# EAGLE design OOBDROID_V1 (EAGLE 7.2.0)
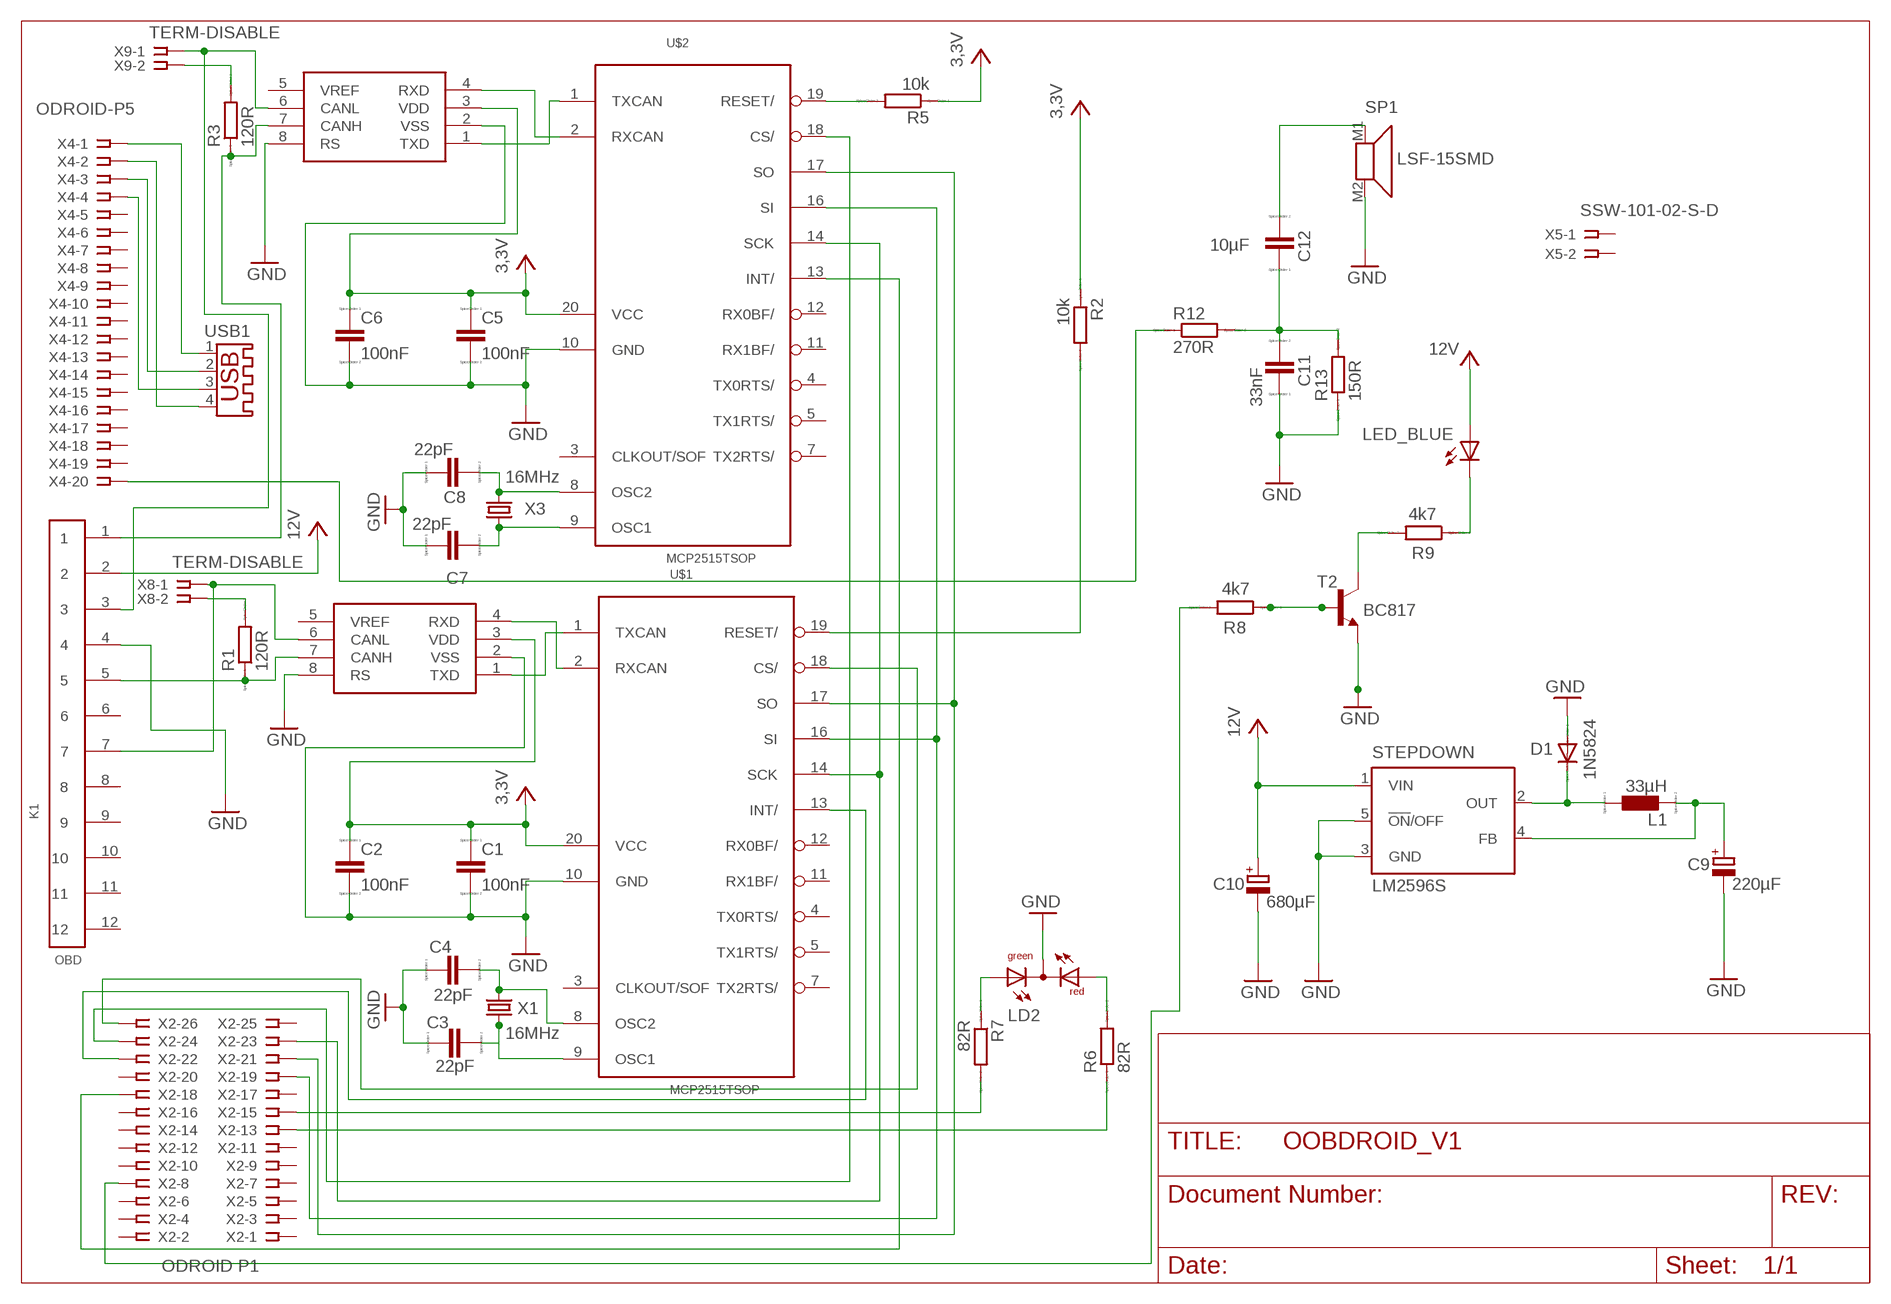
[diagram p0: schematic, sheet 1]

## Parts
C1  100nF  C  [C0805]
C2  100nF  C  [C0805]
C3  22pF  C  [C0805]
C4  22pF  C  [C0805]
C5  100nF  C  [C0805]
C6  100nF  C  [C0805]
C7  22pF  C  [C0805]
C8  22pF  C  [C0805]
C9  220µF  CPOL-EUE1.8-4  [E1,8-4]
C10  680µF  CPOL-EUE1.8-4  [E1,8-4]
C11  33nF  C  [C0805]
C12  10µF  C  [C0805]
D1  1N5824  DIODE-DO214AA  [DO214AA]
K1  OBD  653112124022  [653112124022]
L1  33µH  LL4532P  [L4532P]
LD2  DUOLED-RG-C  [DUOLED-C-5MM]
LED_BLUE  LED5MM  [LED5MM]
R1  120R  RR0603  [R0603]
R2  10k  RR0603  [R0603]
R3  120R  RR0603  [R0603]
R5  10k  RR0603  [R0603]
R6  82R  RR0603  [R0603]
R7  82R  RR0603  [R0603]
R8  4k7  RR0603  [R0603]
R9  4k7  RR0603  [R0603]
R12  270R  RR0603  [R0603]
R13  150R  RR0603  [R0603]
SP1  LSF-15SMD  SMS-1308MS-2-RLSF-15SMD  [SMS-1308MS-2-R]
STEPDOWN  LM2596S  [TO263-5]
T2  BC817  BC847  [SOT23]
U1  MCP2551  [SO08]
U2  MCP2551  [SO08]
U$1  MCP2515TSOP  [TSSOP20]
U$2  MCP2515TSOP  [TSSOP20]
USB1  USB-A003  [USB-A003]
X1  16MHz  CRYSTALS-NOGND-HC49  [HC49]
X2  ODROID P1  SSW-113-02-S-D  [SSW-113-02-S-D]
X3  16MHz  CRYSTALS-NOGND-HC49  [HC49]
X4  ODROID-P5  SSW-120-02-S-S  [SSW-120-02-S-S]
X5  SSW-101-02-S-D  [SSW-101-02-S-D]
X8  TERM-DISABLE  SSW-101-02-S-D  [SSW-101-02-S-D]
X9  TERM-DISABLE  SSW-101-02-S-D  [SSW-101-02-S-D]

## Nets
GND: C1.2 C2.2 C3.1 C4.1 C5.2 C6.2 C7.1 C8.1 C9.- C10.- C11.1 D1.A K1.4 LD2.C R13.1 SP1.M2 STEPDOWN.3(GND) STEPDOWN.5(!ON!/OFF) T2.2(E) U1.2(VSS) U1.8(RS) U2.2(VSS) U2.8(RS) U$1.10(GND) U$2.10(GND)
N$1: K1.5 R1.1 U1.7(CANH)
N$2: D1.C L1.1 STEPDOWN.2(OUT)
N$3: C8.2 U$2.8(OSC2) X3.2
N$4: C9.+ L1.2 STEPDOWN.4(FB)
N$5: C7.2 U$2.9(OSC1) X3.1
N$6: R5.2 U$2.19(RESET/)
N$7: U2.4(RXD) U$2.2(RXCAN)
N$8: U2.1(TXD) U$2.1(TXCAN)
N$9: K1.3 U2.6(CANL) X9.1
N$10: K1.1 R3.1 U2.7(CANH)
N$11: C4.2 U$1.8(OSC2) X1.2
N$12: C3.2 U$1.9(OSC1) X1.1
N$13: R2.2 U$1.19(RESET/)
N$14: U1.4(RXD) U$1.2(RXCAN)
N$15: U1.1(TXD) U$1.1(TXCAN)
N$16: K1.7 U1.6(CANL) X8.1
N$17: C12.2 SP1.M1
N$18: LED_BLUE.K(C) R9.1
N$19: U$1.18(CS/) X2.26
N$21: R3.2 X9.2
N$22: LD2.AR R6.2
N$23: LD2.AX(AG) R7.1
N$24: R7.2 X2.15
N$25: R6.1 X2.13
N$26: USB1.1 X4.1
N$27: USB1.4 X4.2
N$28: USB1.2 X4.3
N$29: USB1.3 X4.4
N$30: R12.1 X4.20
N$31: U$1.13(INT/) X2.22
N$32: U$2.13(INT/) X2.18
N$33: U$2.18(CS/) X2.24
N$34: R9.2 T2.3(C)
N$35: R8.1 T2.1(B)
N$36: R8.2 X2.8
N$37: C11.2 C12.1 R12.2 R13.2
N$38: U$1.16(SI) U$2.16(SI) X2.19
N$39: R1.2 X8.2
N$43: U$1.17(SO) U$2.17(SO) X2.21
N$44: U$1.14(SCK) U$2.14(SCK) X2.23
VCC: C1.1 C2.1 C5.1 C6.1 C10.+ K1.2 LED_BLUE.A R2.1 R5.1 STEPDOWN.1(VIN) U1.3(VDD) U2.3(VDD) U$1.20(VCC) U$2.20(VCC) ; supply symbol labelled 3,3V, 12V
Unconnected: K1.6 K1.8 K1.9 K1.10 K1.11 K1.12 U1.5(VREF) U2.5(VREF) U$1.3(CLKOUT/SOF) U$1.4(TX0RTS/) U$1.5(TX1RTS/) U$1.7(TX2RTS/) U$1.11(RX1BF/) U$1.12(RX0BF/) U$2.3(CLKOUT/SOF) U$2.4(TX0RTS/) U$2.5(TX1RTS/) U$2.7(TX2RTS/) U$2.11(RX1BF/) U$2.12(RX0BF/) X2.1 X2.2 X2.3 X2.4 X2.5 X2.6 X2.7 X2.9 X2.10 X2.11 X2.12 X2.14 X2.16 X2.17 X2.20 X2.25 X4.5 X4.6 X4.7 X4.8 X4.9 X4.10 X4.11 X4.12 X4.13 X4.14 X4.15 X4.16 X4.17 X4.18 X4.19 X5.1 X5.2

## Library data of the parts
C1-C8 C11 C12 = eagle-ltspice:C: CAPACITOR, European symbol; SPICEMODEL: NONE; SPICEPREFIX: C
C9 C10 = resistor:CPOL-EU: POLARIZED CAPACITOR, European symbol
D1 = diode:DIODE-: DIODE
K1 = EagleLibrary_Wuerth_Elektronik _eiCan_Wire_to_Board_Connectors_v6_20150113:653112124022: WR-WTB 1.25mm SMT Male Vertical Shrouded Header, 12 Pins=>Code : Con_WTB_1.25_PCB_SMT_653112124022 <http://katalog.we-online.de/media/thumbs2/eican/thb_Con_WTB_1.25_PCB_SMT_6530xx124022_pf2.psd.jpg> Details see: http://katalog.we-online.de/en/em/653_1xx_124_022 Created 2014-06-06, Karrer Zheng 2014 (C) Würth Elektronik
L1 = eagle-ltspice:L: INDUCTOR, European symbol; SPICEMODEL: NONE; SPICEPREFIX: L
LD2 = led:DUOLED-RG-C: DUO LED 2 colors (red/green), 5 mm, round, common Cathode www.ligitek.com or other producers.
LED_BLUE = adafruit:LED: LED OSRAM: - CHIPLED LG R971, LG N971, LY N971, LG Q971, LY Q971, LO R971, LY R971 LH N974, LH R974 LS Q976, LO Q976, LY Q976 LO Q996 - Hyper CHIPLED LW Q18S LB Q993, LB Q99A, LB R99A - SideLED LS A670, LO A670, LY A670, LG A670, LP A670 LB A673, LV A673, LT A673, LW A673 LH A674 LY A675 LS A676, LA A676, LO A676, LY A676, LW A676 LS A679, LY A679, LG A679 - Hyper Micro SIDELED® LS Y876, LA Y876, LO Y876, LY Y876 LT Y87S - SmartLED LW L88C, LW L88S LB L89C, LB L89S, LG L890 LS L89K, LO L89K, LY L89K LS L896, LA L896, LO L896, LY L896 - TOPLED LS T670, LO T670, LY T670, LG T670, LP T670 LSG T670, LSP T670, LSY T670, LOP T670, LYG T670 LG T671, LOG T671, LSG T671 LB T673, LV T673, LT T673, LW T673 LH T674 LS T676, LA T676, LO T676, LY T676, LB T676, LH T676, LSB T676, LW T676 LB T67C, LV T67C, LT T67C, LS T67K, LO T67K, LY T67K, LW E67C LS E67B, LA E67B, LO E67B, LY E67B, LB E67C, LV E67C, LT E67C LW T67C LS T679, LY T679, LG T679 LS T770, LO T770, LY T770, LG T770, LP T770 LB T773, LV T773, LT T773, LW T773 LH T774 LS E675, LA E675, LY E675, LS T675 LS T776, LA T776, LO T776, LY T776, LB T776 LHGB T686 LT T68C, LB T68C - Hyper Mini TOPLED® LB M676 - Mini TOPLED Santana® LG M470 LS M47K, LO M47K, LY M47K Source: http://www.osram.convergy.de/
R1-R3 R5-R9 R12 R13 = eagle-ltspice:R: RESISTOR, European symbol; SPICEMODEL: NONE; SPICEPREFIX: R
SP1 = speaker:SMS-1308MS-2-R: Speaker 13 x 13mm, 8 Ohm, 0.7W Source: pui audio inc. SMS-1308MS-2-R.pdf
STEPDOWN = national-semiconductor:LM2596: SIMPLE SWITCHER® Power Converter 150 kHz 3A Step-Down Voltage Regulator Source: http://www.national.com/ds/LM/LM2596.pdf; MF: NATIONAL SEMICONDUCTOR; MPN: LM2596S-ADJ/NOPB; OC_FARNELL: 9494367; OC_NEWARK: 41K3842
T2 = transistor:BC847: NPN TRANSISTOR
U1 U2 = SparkFun:MCP2551
U$1 U$2 = MCP2515_MT:MCP2515*: MCP2515 Standalone CAN-Controller by Microchip Eagle-Lib. by MartinThomas
USB1 = con-yamaichi:USB-A003: USB connector; OC_FARNELL: unknown; OC_NEWARK: unknown
X1 X3 = IQD-Frequency-Products:CRYSTALS-NOGND: CRYSTALS CAN NOT GROUNDED
X2 = con-samtec:SSW-113-02-S-D: THROUGH-HOLE .025" SQ POST SOCKET Source: Samtec SSW.pdf; MPN: SSW-113-02-S-D; OC_FARNELL: unknown; OC_NEWARK: 11P9530
X4 = con-samtec:SSW-120-02-S-S: THROUGH-HOLE .025" SQ POST SOCKET Source: Samtec SSW.pdf; MPN: SSW-120-02-S-S; OC_FARNELL: unknown; OC_NEWARK: 11P9641
X5 X9 = con-samtec:SSW-101-02-S-D: THROUGH-HOLE .025" SQ POST SOCKET Source: Samtec SSW.pdf; MPN: SSW-101-02-S-D; OC_FARNELL: unknown; OC_NEWARK: 82P1456
X8 = con-samtec:SSW-101-02-S-D: THROUGH-HOLE .025" SQ POST SOCKET Source: Samtec SSW.pdf; MPN: CAN-DISABLE; OC_FARNELL: unknown; OC_NEWARK: 82P1456

## Net classes
0 default: clearance 0.205 mm

## Board
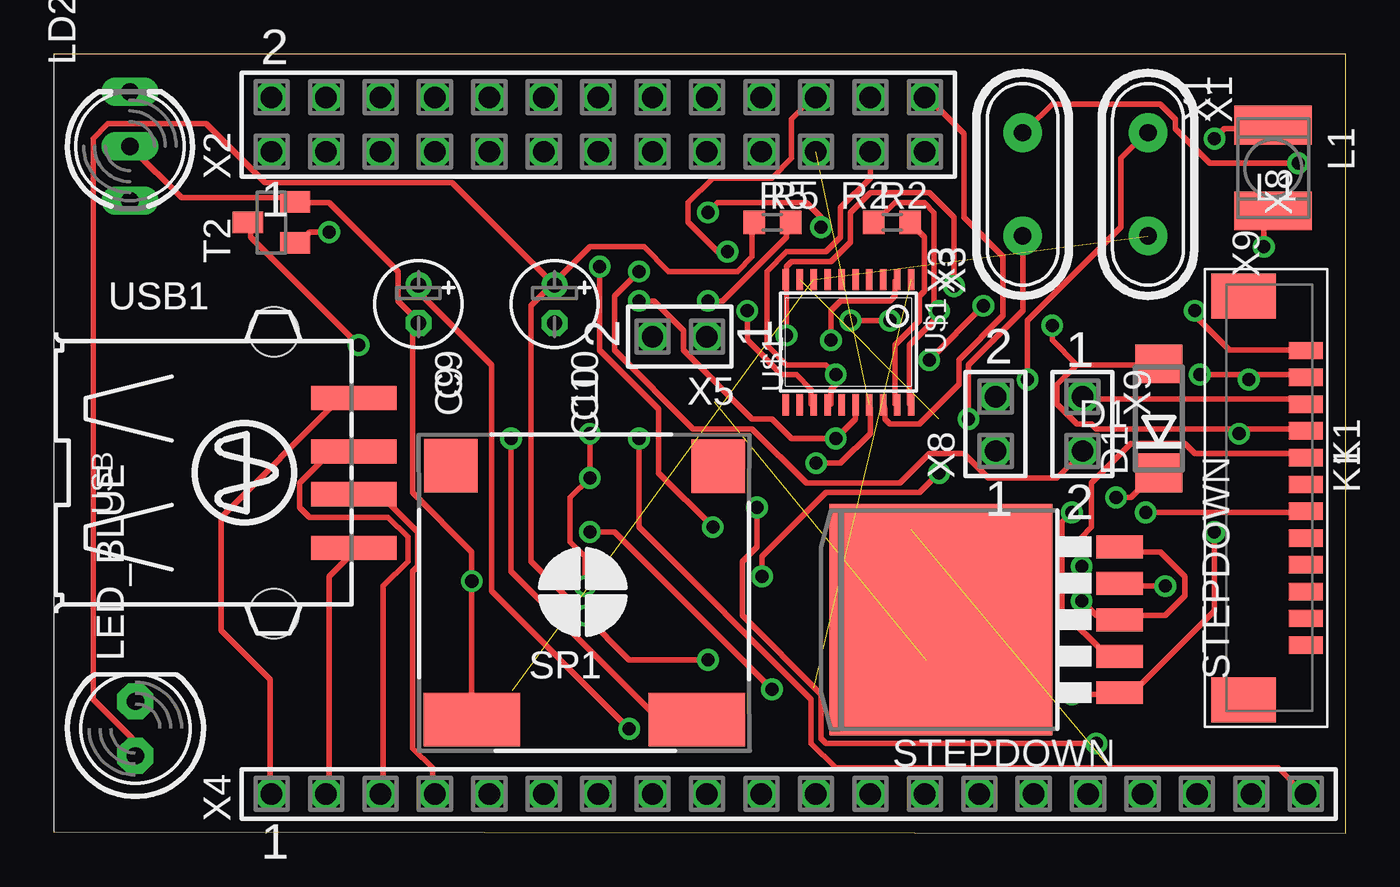
[diagram p1: board, top side]
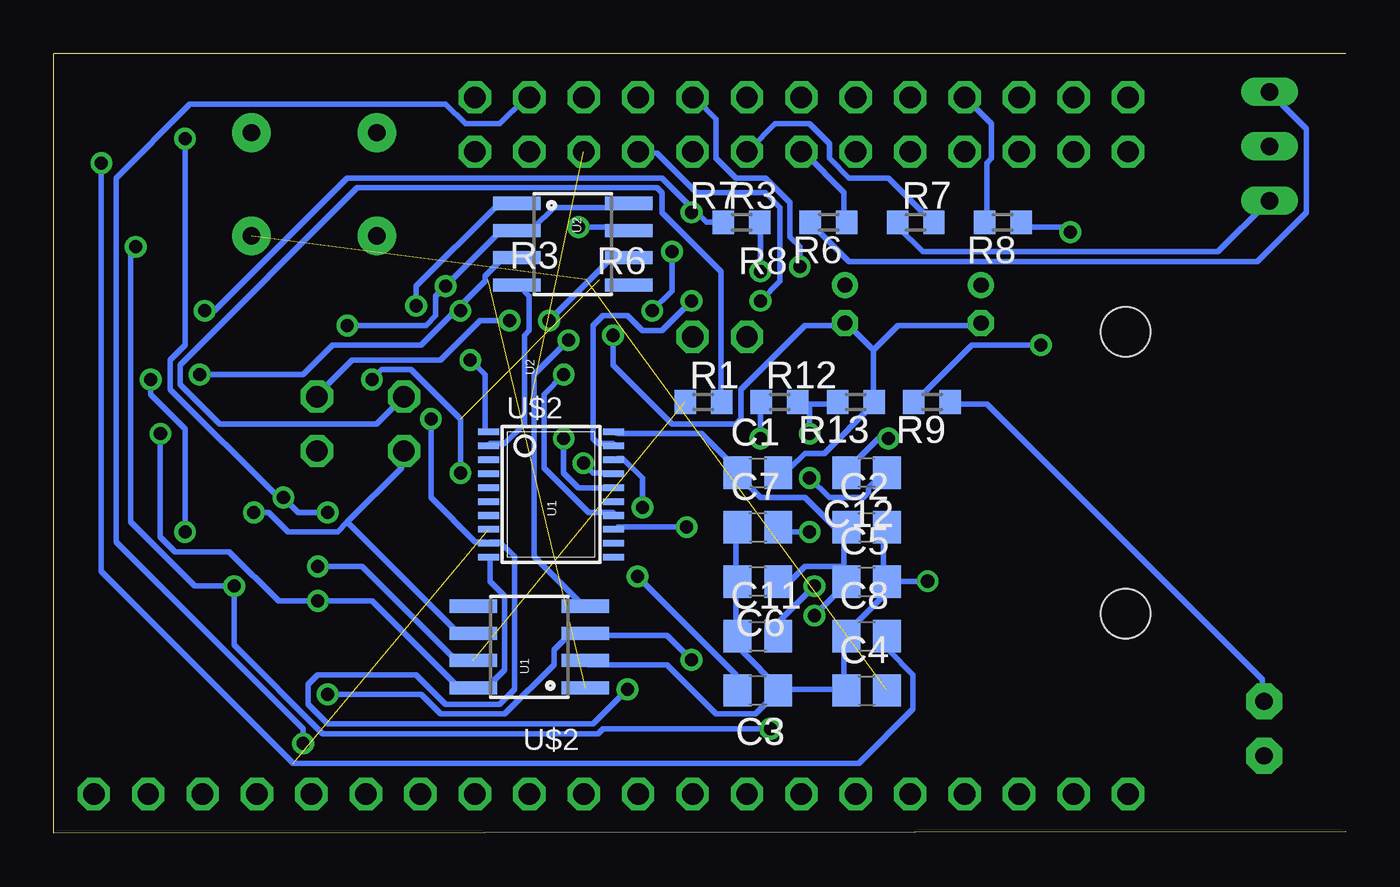
[diagram p2: board, bottom side, seen from below]

Size 60.3 x 36.38 mm. Coordinates in mm from the lower left corner, seen from the top.
Outline: 0.01,0.05 60.3,0 60.3,36.38 0,36.38
Copper layers (1*16): Top 0.035mm / dielectric 1.5mm / Bottom 0.035mm
Design rules "default": minimum track width 10mil, minimum drill 24mil, track to track 8mil, track to pad 8mil, pad to pad 8mil, via to via 8mil, smd to smd 8mil, copper to edge 40mil, drill to drill 8mil, minimum pad ring 10mil, minimum via ring 8mil, stop-mask expansion 4mil, vias tented up to drill 0mil, thermal gap 10mil

### Footprints (pad centres in the part's own frame; a part is rotated, then mirrored left to right if it is on the bottom)
C0805 = smd 1.3 x 1.5: 1 -0.95,0; 2 0.95,0
E1,8-4 = drill 0.711 pad 1.168: + -0.889,0 | drill 0.711 pad 1.168 octagon: - 0.889,0
DO214AA = smd 1.8 x 2.2: A 2.55,0; C -2.55,0
653112124022 = smd 0.81 x 1.6: 1 -0.625,0; 2 0.625,0; 3 1.875,0; 4 3.125,0; 5 4.375,0; 6 5.625,0; 7 6.875,0; 8 8.125,0; 9 9.375,0; 10 10.625,0; 11 11.875,0; 12 13.125,0 | smd 2.1 x 3: Z1 -3.175,-2.9; Z2 15.675,-2.9
L4532P = smd 1.8 x 3.6: 1 -2,0; 2 2,0
DUOLED-C-5MM = drill 0.813 long: AR 2.54,0; AX -2.54,0; C 0,0
LED5MM = drill 0.813 pad 1.676 octagon: A -1.27,0; K 1.27,0
R0603 = smd 1 x 1.1: 1 -0.85,0; 2 0.85,0
SMS-1308MS-2-R = smd 2.5 x 2.5: + 7.636,6.915; - -4.842,6.941 | smd 4.5 x 2.5: M1 6.636,-4.912; M2 -3.851,-4.909
TO263-5 = smd 1.067 x 2.159: 1 -3.404,-5.791; 2 -1.702,-5.791; 3 0,-5.791; 4 1.702,-5.791; 5 3.404,-5.791 | smd 10.8 x 10.41: 6 0,2.54
SOT23 = smd 1 x 1.4: 1 -0.95,-1.1; 2 0.95,-1.1; 3 0,1.1
SO08 = smd 0.61 x 2.21: 1 -1.905,-2.616; 2 -0.635,-2.616; 3 0.635,-2.616; 4 1.905,-2.616; 5 1.905,2.616; 6 0.635,2.616; 7 -0.635,2.616; 8 -1.905,2.616
TSSOP20 = smd 0.305 x 0.991: 1 -2.925,-2.918; 2 -2.275,-2.918; 3 -1.625,-2.918; 4 -0.975,-2.918; 5 -0.325,-2.918; 6 0.325,-2.918; 7 0.975,-2.918; 8 1.625,-2.918; 9 2.275,-2.918; 10 2.925,-2.918; 11 2.925,2.918; 12 2.275,2.918; 13 1.625,2.918; 14 0.975,2.918; 15 0.325,2.918; 16 -0.325,2.918; 17 -0.975,2.918; 18 -1.625,2.918; 19 -2.275,2.918; 20 -2.925,2.918
USB-A003 = smd 1.12 x 4: 1 -3.5,14; 2 -1,14; 3 1,14; 4 3.5,14 | hole 2.3: -6.57,10.28; 6.57,10.28
HC49 = drill 0.813 pad 1.8: 1 -2.413,0; 2 2.413,0
SSW-113-02-S-D = drill 1 pad 1.5 octagon: 1 -15.24,-1.27; 2 -15.24,1.27; 3 -12.7,-1.27; 4 -12.7,1.27; 5 -10.16,-1.27; 6 -10.16,1.27; 7 -7.62,-1.27; 8 -7.62,1.27; 9 -5.08,-1.27; 10 -5.08,1.27; 11 -2.54,-1.27; 12 -2.54,1.27; 13 0,-1.27; 14 0,1.27; 15 2.54,-1.27; 16 2.54,1.27; 17 5.08,-1.27; 18 5.08,1.27; 19 7.62,-1.27; 20 7.62,1.27; 21 10.16,-1.27; 22 10.16,1.27; 23 12.7,-1.27; 24 12.7,1.27; 25 15.24,-1.27; 26 15.24,1.27
SSW-120-02-S-S = drill 1 pad 1.5 octagon: 1 -24.13,0; 2 -21.59,0; 3 -19.05,0; 4 -16.51,0; 5 -13.97,0; 6 -11.43,0; 7 -8.89,0; 8 -6.35,0; 9 -3.81,0; 10 -1.27,0; 11 1.27,0; 12 3.81,0; 13 6.35,0; 14 8.89,0; 15 11.43,0; 16 13.97,0; 17 16.51,0; 18 19.05,0; 19 21.59,0; 20 24.13,0
SSW-101-02-S-D = drill 1 pad 1.5 octagon: 1 0,-1.27; 2 0,1.27

### Placement (x,y rotation side)
C1  27.44,16.82 0 bottom
C2  22.36,14.28 0 bottom
C3  27.44,6.66 180 bottom
C4  22.36,6.66 0 bottom
C5  22.36,11.74 0 bottom
C6  27.44,11.74 180 bottom
C7  27.44,14.28 0 bottom
C8  22.36,9.2 0 bottom
C9  17.03,24.69 270 top
C10  23.38,24.69 270 top
C11  27.44,9.2 0 bottom
C12  22.36,16.82 180 bottom
D1  51.57,19.36 90 top
K1  58.43,21.9 270 top
L1  56.9,31.04 270 top
LD2  3.56,32.06 90 top
LED_BLUE  3.82,4.88 90 top
R1  29.98,20.12 0 bottom
R2  39.12,28.5 0 top
R3  28.2,28.5 0 bottom
R5  33.54,28.5 0 top
R6  24.14,28.5 180 bottom
R7  20.07,28.5 0 bottom
R8  16.01,28.5 180 bottom
R9  19.31,20.12 180 bottom
R12  26.42,20.12 0 bottom
R13  22.87,20.12 180 bottom
SP1  23.38,10.21 0 top
STEPDOWN  43.95,9.96 90 top
T2  10.17,28.5 90 top
U1  38.11,8.69 90 bottom
U2  36.08,27.49 270 bottom
U$1  37.09,22.91 180 top
U$2  37.09,15.8 270 bottom
USB1  0.01,16.82 270 top
X1  51.06,30.28 270 top
X2  25.41,33.07 0 top
X3  45.22,30.28 90 top
X4  34.3,1.83 0 top
X5  29.22,23.17 90 top
X8  43.95,19.1 0 top
X9  48.01,19.1 180 top

### Tracks (layer width: path | path; a pad name or v marks a point on that pad's centre or on a via)
GND  (via drill 0.61)
  Top 0.254: STEPDOWN.5 49.81,13.14 51.65,13.14 52.79,11.99 52.79,11.07 51.87,10.15 49.81,10.15 STEPDOWN.3 49.58,10.15 48.66,10.15 v47.97,10.84 | 55.32,18.87 48.66,18.87 48.43,19.1 47.74,19.1 46.83,20.02 46.83,20.94 47.74,21.86 | 55.32,18.87 58.3,18.87 K1.4 | 47.74,21.86 51.42,21.86 D1.A | v46.6,23.69 46.6,23 47.74,21.86 | 55.32,18.87 v55.32,18.64 | LD2.C 3.68,31.96 5.97,29.66 11.25,29.66 T2.2 11.48,29.43 12.86,29.43 16.07,26.22 16.07,24.84 16.99,23.92 C9.- 16.99,23.69 16.76,23.46 16.76,15.89 19.52,13.14 v19.52,11.76 19.52,5.33 SP1.M2 | v34.2,23.23 34.2,25.76 U$1.10 34.2,25.99 34.2,26.45 34.43,26.68 36.27,26.68 37.19,27.59 37.19,28.97 38.1,29.89 40.86,29.89 42.01,28.74 v42.01,25.53
  Bottom 0.254: U$2.10 39.94,12.91 39.94,11.76 39.25,11.07 39.25,7.63 39.94,6.94 40.63,6.94 U1.8 40.86,6.94 41.55,6.94 45.45,10.84 v47.97,10.84 49.81,10.84 52.1,13.14 54.63,13.14 55.32,13.82 v55.32,18.64 | U2.8 33.51,29.2 36.96,29.2 37.87,28.28 38.56,28.28 U2.2 38.79,28.05 39.48,28.05 v42.01,25.53 42.47,25.07 42.47,24.15 42.92,23.69 v46.6,23.69 | C7.1 28.47,14.05 28.47,11.76 C6.2 28.47,11.53 28.47,9.23 C11.1 28.24,9 28.24,8.55 26.4,6.71 | C5.2 21.58,11.76 21.58,14.05 C2.2 | 23.42,6.71 23.42,9 C8.1 23.42,9.23 21.58,11.07 21.58,11.53 C5.2 | 23.42,6.71 26.4,6.71 | 23.42,6.71 C4.1 | U1.2 35.35,7.86 31.68,7.86 29.38,5.56 27.55,5.56 26.63,6.48 C3.1 26.4,6.71 | v34.2,23.23 34.2,21.86 31.45,19.1 28.47,19.1 28.24,19.33 28.24,20.71 25.25,23.69 23.42,23.69 C10.- 23.19,23.69 22.04,22.55 | 22.04,22.55 22.04,20.25 R13.1 22.04,20.02 24.33,17.73 25.25,17.73 25.94,17.04 26.4,17.04 C1.2 | 22.04,22.55 20.89,23.69 17.22,23.69 C9.- | v19.52,11.76 21.35,11.76 C5.2
N$1  (via drill 0.61)  (1 unrouted)
  Top 0.254: v47.97,12.45 47.97,13.82 48.43,14.28 48.43,16.35 50.27,18.19 52.79,18.19 53.25,17.73 58.3,17.73 K1.5
  Bottom 0.254: v47.97,12.45 45.91,12.45 41.55,8.09 40.86,8.09 U1.7
N$2  (via drill 0.61)
  Top 0.254: v47.51,14.97 47.05,14.51 47.05,10.38 49.12,8.32 49.58,8.32 STEPDOWN.2 | v49.58,15.66 50.27,15.66 51.42,16.81 D1.C | v54.17,32.41 54.63,32.87 56.69,32.87 L1.1
  Bottom 0.254: v47.51,14.97 48.89,14.97 v49.58,15.66 49.81,15.66 54.86,20.71 54.86,22.09 54.17,22.78 v54.17,32.41
N$3  (via drill 0.61)  (1 unrouted)
  Top 0.254: v58.07,31.27 53.94,31.27 52.33,32.87 52.33,33.33 51.65,34.02 46.6,34.02 45.45,32.87 X3.2
  Bottom 0.254: v58.07,31.27 58.07,12.22 49.12,3.27 22.73,3.27 20.2,5.79 20.2,7.4 21.35,8.55 21.35,9 C8.2
N$4  (via drill 0.61)
  Top 0.254: v51.87,11.53 49.81,11.53 STEPDOWN.4 | v56.46,27.37 56.46,28.74 56.69,28.97 L1.2 | v26.86,4.87 20.43,11.3 20.43,21.86 17.22,25.07 17.22,25.53 C9.+
  Bottom 0.254: v56.46,27.37 56.69,27.14 56.69,14.51 53.71,11.53 v51.87,11.53 51.87,8.78 47.74,4.64 34.89,4.64 34.66,4.87 v26.86,4.87
N$5  (via drill 0.61)
  Top 0.254: v42.69,19.33 42.69,21.86 45.22,24.38 45.22,27.82 X3.1 | v25.02,14.05 26.17,14.05 v33.51,6.71
  Bottom 0.254: v42.69,19.33 42.69,15.66 40.63,13.59 40.17,13.59 U$2.9 39.94,13.59 39.48,13.59 38.79,12.91 38.79,6.71 39.48,6.02 42.01,6.02 43.38,7.4 47.97,7.4 48.43,6.94 48.43,6.02 47.51,5.1 35.12,5.1 v33.51,6.71 | v25.02,14.05 26.4,14.05 C7.2
N$6  (via drill 0.61)
  Top 0.254: v30.53,24.84 31.22,24.84 34.2,27.82 34.2,28.28 R5.2
  Bottom 0.254: v30.53,24.84 31.91,23.46 32.83,23.46 33.51,24.15 34.66,24.15 35.12,23.69 35.12,18.41 34.89,18.19 34.2,18.19 U$2.19
N$7
  Bottom 0.254: U$2.2 39.94,18.19 39.25,18.19 38.33,19.1 38.33,23.23 38.1,23.46 38.1,25.07 38.56,25.53 U2.4
N$8  (via drill 0.61)
  Top 0.254: v43.38,24.61 v40.86,22.09
  Bottom 0.254: v40.86,22.09 40.17,21.4 40.17,18.87 U$2.1 | v43.38,24.61 43.38,25.53 39.71,29.2 38.79,29.2 U2.1
N$9  (via drill 0.61)
  Top 0.254: K1.3 58.3,20.25 48.2,20.25 X9.1 | v39.02,23.92 v37.19,23.92
  Bottom 0.254: v37.19,23.92 34.43,26.68 33.51,26.68 U2.6 | v39.02,23.92 40.4,23.92 42.24,22.09 46.37,22.09 47.97,20.48 X9.1
N$10  (via drill 0.61)
  Top 0.254: v53.25,24.38 53.25,24.15 54.86,22.55 58.3,22.55 K1.1 | v35.81,28.28 35.81,28.74 35.12,29.43 30.99,29.43 v30.53,28.97
  Bottom 0.254: 30.3,28.97 31.91,30.58 46.6,30.58 52.79,24.38 v53.25,24.38 | 30.3,28.97 29.84,28.51 29.15,28.51 R3.1 | v35.81,28.28 33.51,28.28 U2.7 | 30.3,28.97 v30.53,28.97
N$11  (2 unrouted)
N$12  (via drill 0.61)  (1 unrouted)
  Top 0.254: v33.06,11.99 33.06,12.91 36.04,15.89 40.4,15.89 v41.32,16.81 | v45.45,21.17 45.45,23.92 49.81,28.28 49.81,31.5 50.96,32.64 X1.1
  Bottom 0.254: v33.06,11.99 28.47,7.4 28.47,6.71 C3.2 | v41.32,16.81 41.32,19.33 43.61,21.63 44.99,21.63 v45.45,21.17
N$13
  Top 0.254: U$1.19 39.25,20.02 39.25,22.78 40.4,23.92 40.4,25.07 40.63,25.3 40.63,27.82 40.17,28.28 R2.2
N$14  (via drill 0.61)
  Top 0.254: v36.27,23 36.27,24.38 36.73,24.84 39.02,24.84 39.25,25.07 39.25,25.76 U$1.2
  Bottom 0.254: v36.27,23 37.87,21.4 37.87,12.91 35.58,10.61 U1.4
N$15  (1 unrouted)
N$16  (via drill 0.61)
  Top 0.254: v50.96,14.97 58.3,14.97 K1.7
  Bottom 0.254: v50.96,14.97 50.27,14.97 49.35,14.05 47.05,14.05 46.6,14.51 | 46.6,14.51 44.07,17.04 44.07,17.73 X8.1 | 46.6,14.51 41.55,9.46 40.86,9.46 U1.6
N$17  (via drill 0.61)
  Top 0.254: v21.35,18.41 21.35,12.22 28.24,5.33 29.84,5.33 SP1.M1
  Bottom 0.254: v21.35,18.41 21.81,18.41 23.19,17.04 C12.2
N$18
  Bottom 0.254: R9.1 18.37,20.02 16.76,20.02 3.91,7.17 3.91,6.25 LED_BLUE.K
N$19
  Top 0.254: U$1.18 38.79,19.79 38.79,19.33 39.02,19.1 40.4,19.1 42.24,20.94 42.24,22.09 44.3,24.15 44.3,26.91 42.47,28.74 42.47,32.64 40.86,34.25 X2.26
N$21  (via drill 0.61)
  Top 0.254: v27.32,26.22 26.17,25.07 26.17,22.55 29.84,18.87 32.6,18.87 35.12,16.35 39.48,16.35 40.86,17.73 42.47,17.73 43.61,16.58 46.83,16.58 47.97,17.73 X9.2
  Bottom 0.254: v27.32,26.22 27.32,28.28 R3.2
N$22
  Bottom 0.254: R6.2 24.79,28.28 23.19,26.68 4.14,26.68 1.84,28.97 1.84,32.87 3.45,34.48 LD2.AR
N$23
  Bottom 0.254: R7.1 20.89,28.28 19.74,27.14 5.97,27.14 3.68,29.43 LD2.AX
N$24
  Bottom 0.254: R7.2 19.29,28.51 21.35,30.58 23.19,30.58 24.11,31.5 24.11,32.18 25.02,33.1 26.63,33.1 27.78,31.96 X2.15
N$25
  Bottom 0.254: R6.1 23.42,28.51 23.42,29.89 25.25,31.73 X2.13
N$26
  Top 0.254: X4.1 10.11,1.89 10.11,7.17 7.81,9.46 7.81,14.74 13.32,20.25 14.01,20.25 USB1.1
N$27
  Top 0.254: X4.2 12.86,1.89 12.86,11.99 14.01,13.14 USB1.4
N$28
  Top 0.254: X4.3 15.38,1.89 15.38,11.53 16.53,12.68 16.53,13.82 15.61,14.74 11.94,14.74 11.48,15.2 11.48,16.35 12.86,17.73 14.01,17.73 USB1.2
N$29
  Top 0.254: X4.4 17.68,1.89 17.68,3.04 16.76,3.96 16.76,12.22 16.99,12.45 16.99,14.05 15.38,15.66 14.24,15.66 USB1.3
N$30  (via drill 0.61)
  Top 0.254: v27.32,18.41 27.32,14.28 35.35,6.25 35.35,4.19 36.5,3.04 57.15,3.04 58.3,1.89 X4.20
  Bottom 0.254: v27.32,18.41 27.32,20.02 R12.1
N$31  (via drill 0.61)
  Top 0.254: v32.37,24.38 32.37,23 33.97,21.4 34.66,21.4 35.35,20.71 35.35,20.02 U$1.13 | v31.45,27.14 30.99,27.14 29.61,28.51 29.61,29.43 30.76,30.58 33.51,30.58 34.43,31.5 34.43,33.33 35.35,34.25 X2.22
  Bottom 0.254: v32.37,24.38 31.45,25.3 v31.45,27.14
N$32  (via drill 0.61)
  Top 0.254: v30.76,14.28 28.24,16.81 28.24,19.79 25.48,22.55 v25.48,26.45
  Bottom 0.254: v30.76,14.28 33.97,14.28 U$2.13 | v25.48,26.45 25.48,27.37 25.94,27.82 25.94,29.43 27.09,30.58 28.47,30.58 29.38,31.5 29.38,33.33 30.3,34.25 X2.18
N$33  (via drill 0.61)
  Top 0.254: v32.83,15.2 32.83,13.37 32.14,12.68 32.14,10.15 35.81,6.48 35.81,4.42 36.04,4.19 v48.66,4.19
  Bottom 0.254: v32.83,15.2 32.83,16.58 33.74,17.5 33.97,17.5 U$2.18 | v48.66,4.19 48.66,4.87 57.38,13.59 57.38,30.58 53.94,34.02 42.01,34.02 41.09,33.1 39.48,33.1 38.33,34.25 X2.24
N$34  (via drill 0.61)
  Top 0.254: v14.24,22.78 9.19,27.82 9.19,28.28 T2.3
  Bottom 0.254: v14.24,22.78 17.45,22.78 19.97,20.25 R9.2
N$35  (via drill 0.61)
  Top 0.254: v12.86,28.05 11.94,28.05 11.48,27.59 T2.1
  Bottom 0.254: v12.86,28.05 13.09,28.28 15.15,28.28 R8.1
N$36
  Bottom 0.254: R8.2 16.76,28.51 16.76,31.27 16.53,31.5 16.53,33.1 17.68,34.25 X2.8
N$37  (via drill 0.61)
  Top 0.254: v25.02,18.64 v25.02,16.58 24.11,15.66 24.11,13.59 24.79,12.91 v24.79,11.53
  Bottom 0.254: 25.02,20.02 25.48,20.02 R12.2 | 25.02,20.02 23.88,20.02 R13.2 | v25.02,16.58 24.11,15.66 22.5,15.66 22.27,15.89 22.27,16.12 21.58,16.81 C12.1 | 25.02,20.02 v25.02,18.64 | v24.79,11.53 26.4,9.92 26.4,9.23 C11.2
N$38  (via drill 0.61)
  Top 0.254: U$1.16 37.42,19.79 37.42,19.33 v36.5,18.41 34.43,18.41 33.51,19.33 32.6,19.33 29.38,22.55 29.38,23.46 28.01,24.84 v27.32,24.84
  Bottom 0.254: v36.5,18.41 36.5,16.81 35.81,16.12 34.2,16.12 U$2.16 | v27.32,24.84 26.4,25.76 26.4,29.2 27.09,29.89 30.3,29.89 32.14,31.73 32.83,31.73 X2.19
N$39
  Bottom 0.254: R1.2 29.15,20.25 29.15,26.22 31.91,28.97 31.91,29.89 32.14,30.12 46.14,30.12 54.4,21.86 54.4,20.94 52.56,19.1 45.22,19.1 44.07,20.25 X8.2
N$43  (via drill 0.61)  (1 unrouted)
  Top 0.254: v35.58,17.27 36.73,17.27 38.1,18.64 38.1,19.79 U$1.17
  Bottom 0.254: v35.58,17.27 35.12,16.81 34.2,16.81 U$2.17
N$44  (via drill 0.61)
  Top 0.254: U$1.14 36.27,20.02 36.27,20.71 36.5,20.94 v36.5,21.4 36.04,21.86 34.2,21.86 33.29,22.78 33.29,26.22 34.2,27.14 36.04,27.14 36.73,27.82 36.73,29.2 38.1,30.58 38.1,31.73 X2.23
  Bottom 0.254: v36.5,21.4 37.42,20.48 37.42,17.04 35.35,14.97 34.2,14.97 U$2.14
VCC  (via drill 0.61)
  Top 0.254: 41.09,24.38 41.09,28.97 40.63,29.43 39.25,29.43 38.33,28.51 R2.1 | 41.09,24.38 41.09,23.92 39.94,22.78 39.94,20.02 U$1.20 | v53.48,21.4 55.78,21.4 | 55.78,21.4 58.3,21.4 K1.2 | v41.32,24.38 41.09,24.38 | v47.51,6.48 49.58,6.48 STEPDOWN.1 49.81,6.71 50.5,6.71 54.17,10.38 v54.17,14.05 | R5.1 32.6,28.28 32.6,26.91 31.91,26.22 28.7,26.22 27.55,27.37 25.02,27.37 23.42,25.76 C10.+ | LED_BLUE.A 3.68,3.73 3.68,4.42 1.84,6.25 1.84,32.41 2.53,33.1 7.12,33.1 9.88,30.35 18.6,30.35 23.19,25.76 C10.+ | C10.+ 23.19,25.53 22.27,24.61 22.27,12.68 v24.79,10.15 26.86,8.09 v30.53,8.09 | v55.78,21.17 55.78,21.4
  Bottom 0.254: v53.48,21.4 48.66,21.4 47.28,22.78 43.15,22.78 41.32,24.61 | 41.32,24.61 40.17,25.76 40.17,25.99 39.48,26.68 38.79,26.68 U2.3 | 41.32,24.61 v41.32,24.38 | v47.51,6.48 43.15,6.48 42.24,5.56 39.25,5.56 36.96,7.86 36.96,8.55 36.27,9.23 35.58,9.23 U1.3 35.35,9.23 31.68,9.23 v30.53,8.09 | 23.42,12.45 23.42,14.05 C2.1 23.42,14.28 23.88,14.28 25.25,15.66 27.32,15.66 28.47,16.81 C1.1 28.47,17.04 30.07,18.64 33.97,18.64 U$2.20 | 23.42,12.45 23.42,11.76 C5.1 | 23.42,12.45 25.25,12.45 25.94,11.76 26.4,11.76 C6.1 | 23.42,12.45 C5.1 | v24.79,10.15 23.42,11.53 C5.1 | v55.78,21.17 55.78,20.48 54.17,18.87 v54.17,14.05

### Text on the board
_tNames: LD2 | X1 | X8 | L1 | X2 | R5 | R2 | T2 | X9 | X3 | USB1 | C9 | C10 | X5 | U$1 | D1 | STEPDOWN | K1 | LED_BLUE | SP1 | X4
_bNames: R7 | R3 | R8 | R6 | R12 | R1 | U2 | R9 | R13 | C1 | C12 | C2 | C7 | U1 | C5 | C8 | C6 | C11 | C4 | C3 | U$2